# Altium schematic sheet RFM95.SchDoc
size A4; SheetNumber: 5; SheetTotal: 6
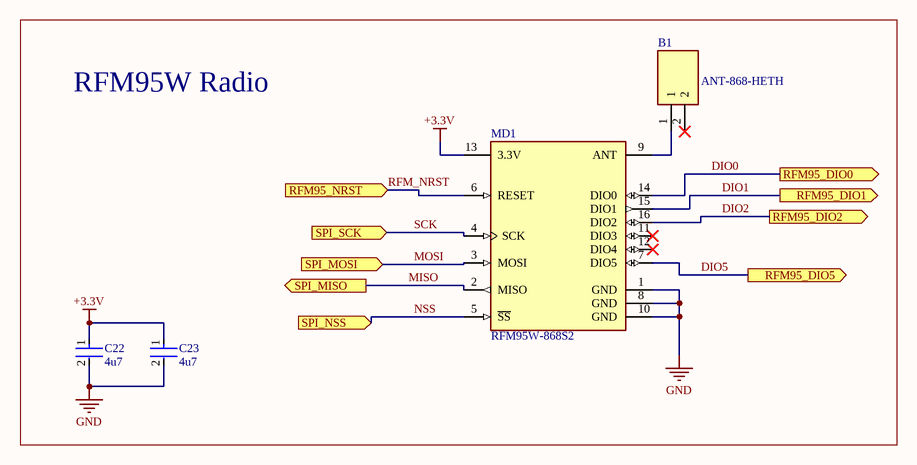
[diagram p0: RFM95.SchDoc]

## Parts
B1  ANT-868-HETH  [ANT-868-HETH-Footprint-1]
C22  4u7  [FP-GRM21B-0_15-MFG]
C23  4u7  [FP-GRM21B-0_15-MFG]
MD1  RFM95W-868S2  [FP-RFM95W-868S2-MFG]

## Blocks framed on the sheet
RFM95W Radio: B1 C22 C23 MD1

## Ports
RFM95_DIO0 (out, see MCU[4A], Sheet3[2B], Sheet3[7B]), RFM95_DIO1 (out, see MCU[4A], Sheet3[2B], Sheet3[7B]), RFM95_DIO2 (out, see MCU[4A], Sheet3[2B], Sheet3[7B]), RFM95_DIO5 (out, see MCU[2A], Sheet3[2B], Sheet3[6B]), RFM95_NRST (in, see MCU[4A], Sheet3[1B], Sheet3[7B]), SPI_MISO (out, see MCU[2B], Sheet3[1B], Sheet3[6B]), SPI_MOSI (in, see MCU[2B], Sheet3[1B], Sheet3[6B]), SPI_NSS (in, see MCU[4A], Sheet3[1B], Sheet3[7B]), SPI_SCK (in, see MCU[3A], Sheet3[1B], Sheet3[6B])

## Nets
+3.3V: C22.1 C23.1 MD1.13(3.3V)
GND: C22.2 C23.2 MD1.1(GND) MD1.8(GND) MD1.10(GND)
DIO0: MD1.14(DIO0) ; port RFM95_DIO0
DIO1: MD1.15(DIO1) ; port RFM95_DIO1
DIO2: MD1.16(DIO2) ; port RFM95_DIO2
DIO5: MD1.7(DIO5) ; port RFM95_DIO5
MISO: MD1.2(MISO) ; port SPI_MISO
MOSI: MD1.3(MOSI) ; port SPI_MOSI
NSS: MD1.5(~{SS}) ; port SPI_NSS
RFM_NRST: MD1.6(RESET) ; port RFM95_NRST
SCK: MD1.4(SCK) ; port SPI_SCK
NetB1_1: B1.1 MD1.9(ANT)

Not connected (* = marked no-connect by the designer): B1 2*; MD1 11(DIO3)* 12(DIO4)*

## Library data of the parts
B1 = CMP-00030-00001-2: RF/Microwave Antenna
C22 C23 = CMP-06035-005997-1: Chip Multilayer Ceramic Capacitors for General Purpose, 0805, 4.7uF, X7R, 15%, 10%, 10V; Tolerance: 10%; Capacitance: 4.7uF; Width: 1.25mm; Case/Package: 0805; Voltage Rating (DC): 10V; Thickness: 1.25mm; Dielectric: X7R; Length: 2mm
MD1 = CMP-204316-000001-1: RX TXRX MODULE ISM < 1GHZ SMD; Data Rate: 300Kbps; Frequency: 868MHz; Sensitivity: -123dBm; Interface: SPI; Current - Transmitting: 120mA; Current - Receiving: 12.1mA; Max Operating Temperature: 70°C; Case/Package: SMD/SMT; Packaging: Bulk; Mount: Surface Mount; Min Operating Temperature: -20°C